# Altium schematic sheet Altium Simulation.SchDoc
size A4; Organization: ArSilicii s.r.l.; Address1: Via Sardegna, 11; Address2: 53036 Poggibonsi (SI)  - ITALY -; Address3: e-mail : ArSilicii@ArSilicii.com; SheetNumber: 0; SheetTotal: 0
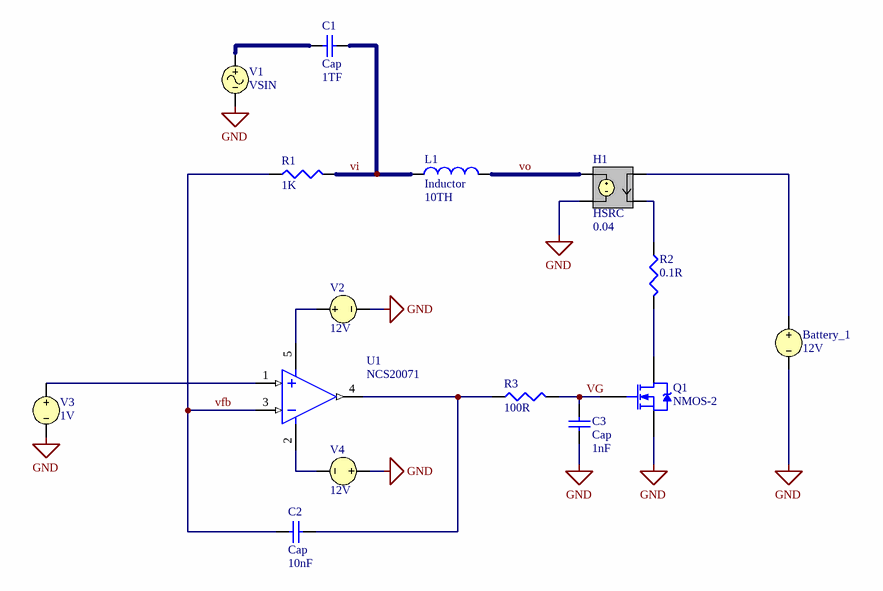
[diagram p0: Altium Simulation.SchDoc]

## Parts
Battery_1  12V
C1  Cap  value 1TF  [RAD-0.3]
C2  Cap  value 10nF  [RAD-0.3]
C3  Cap  value 1nF  [RAD-0.3]
H1  HSRC  Gain: 0.04
L1  Inductor  value 10TH  [0402-A]
Q1  NMOS-2  [TO-220AB]
R1  1K  [J1-0603]
R2  0.1R  [J1-0603]
R3  100R  [J1-0603]
U1  NCS20071  [SOT-553-5]
V1  VSIN
V2  12V
V3  1V
V4  12V

## Nets
GND: Battery_1.2 C3.1 H1.4(N-) Q1.3(S) V1.2 V2.2 V3.2 V4.1
vfb: C2.1 R1.1 U1.3
VG: C3.2 Q1.1(G) R3.2
vi: C1.1 L1.1 R1.2
vo: H1.3(N+) L1.2
NetBattery_1_1: Battery_1.1 H1.1(NC+)
NetC1_2: C1.2 V1.1
NetC2_2: C2.2 R3.1 U1.4
NetH1_2: H1.2(NC-) R2.1
NetQ1_2: Q1.2(D) R2.2
NetU1_1: U1.1 V3.1
NetU1_2: U1.2 V4.2
NetU1_5: U1.5 V2.1

## Notes on the sheet
- Title :
- Size:
- Date:
- A4
- Version:
- Sheet
- of
- Designer:
- Revisor:

## Library data of the parts
Battery_1 V2-V4 = VSRC: Voltage Source; Note: PCB Footprint - Not required; Published: 8-Jun-2000; LatestRevisionDate: 17-Jul-2002; LatestRevisionNote: Re-released for DXP Platform.; PackageReference: Not Applicable; Publisher: Altium Limited
  Battery_1 V2 V4: Value: 12V
  V3: Value: 1V
C1-C3 = Cap: Capacitor; Published: 8-Jun-2000; LatestRevisionDate: 17-Jul-2002; LatestRevisionNote: Re-released for DXP Platform.; PackageReference: RAD-0.3; Publisher: Altium Limited; PackageDescription: Radial Cap, Thru-Hole; 2 Leads; 0.3 in Pin Spacing
H1 = HSRC: Current Controlled Voltage Source; Note: PCB Footprint - Not required; Sim Note: Enter gain into gain field; Published: 8-Jun-2000; LatestRevisionDate: 17-Jul-2002; LatestRevisionNote: Re-released for DXP Platform.; PackageReference: Not Applicable; Publisher: Altium Limited
L1 = Inductor: Code_IEC: 1005; Published: 8-Jun-2000; LatestRevisionDate: 29-May-2009; LatestRevisionNote: IPC-7351 Footprint Added.; PackageReference: 0402-A; Publisher: Altium Limited; PackageDescription: Chip Inductor; Code_JEITA: 0402
Q1 = NMOS-2: N-Channel Power MOSFET; Note: Pin 2 is electrically connected to pin 4.; Published: 8-Jun-2000; LatestRevisionDate: 17-Jul-2002; LatestRevisionNote: Re-released for DXP Platform.; DatasheetVersion: PD-9.814; PackageVersion: Feb-1997; PackageReference: TO-220AB; Publisher: Altium Limited; PackageDescription: TO, Thru-Hole, Vertical, Heatsink Mounted; 3 In-Line Leads; Pitch 2.54 mm; ComponentLink1Description: Manufacturer Link; ComponentLink1URL: http://www.irf.com/
R1-R3 = Res3: Resistor; Published: 8-Jun-2000; LatestRevisionDate: 29-May-2009; LatestRevisionNote: IPC-7351 Footprint Added.; PackageReference: J1-0603; Publisher: Altium Limited; PackageDescription: Chip Resistor
  R1: Value: 1K
  R2: Value: 0.1R; Parameter 1: *
  R3: Value: 100R
U1 = NCS20071: Rail-to-Rail Input/Output, 3 MHz Op Amps; Manufacturer: Microchip Technology; Manufacturer Part Number: MCP6021-E/SN; SMD/TH: SMD; 1 Supplier: DigiKey; 1 Supplier Part Number: MCP6021-E/SN-ND; 1 Supplier Unit Price: 1,22; 2 Supplier: *; 2 Supplier Part Number: *; 2 Supplier Unit Price: *; 3 Supplier: *; 3 Supplier Part Number: *; 3 Supplier Unit Price: *; ArSilicii Part Number: *; ComponentLink1URL: http://ww1.microchip.com/downloads/en/DeviceDoc/21685d.pdf; ComponentLink2URL: *; ComponentLink1Description: Datasheet for MCP6021; ComponentLink2Description: *; HelpURL: *
V1 = VSIN: Sinusoidal Voltage Source; Note: PCB Footprint - Not required; Published: 8-Jun-2000; LatestRevisionDate: 15-Nov-2004; LatestRevisionNote: Corrected Netlist.; PackageReference: Not Applicable; Publisher: Altium Limited